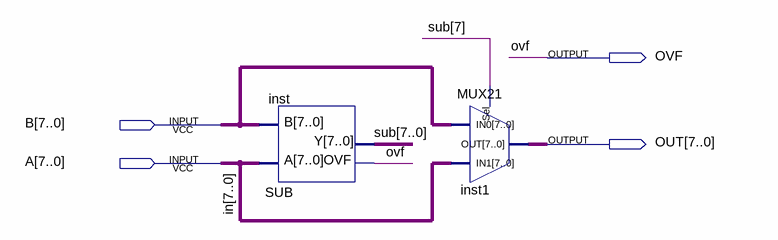
[diagram p0: schematic sheet]
// Quartus schematic MIN.bdf as structural Verilog: 2 symbols, 4 pins
module MIN (
  input  [7:0] B,
  input  [7:0] A,
  output OVF,
  output [7:0] OUT
);

  wire [7:0] sub;

  SUB inst (.A(A), .B(B), .OVF(OVF), .Y(sub));
  MUX21 inst1 (.Sel(sub[7]), .IN0(B), .IN1(A), .OUT(OUT));

  // Other names for the same wires on the sheet: in[7:0] = A
endmodule
